# Altium schematic sheet Morpheus_conector.SchDoc
size A4
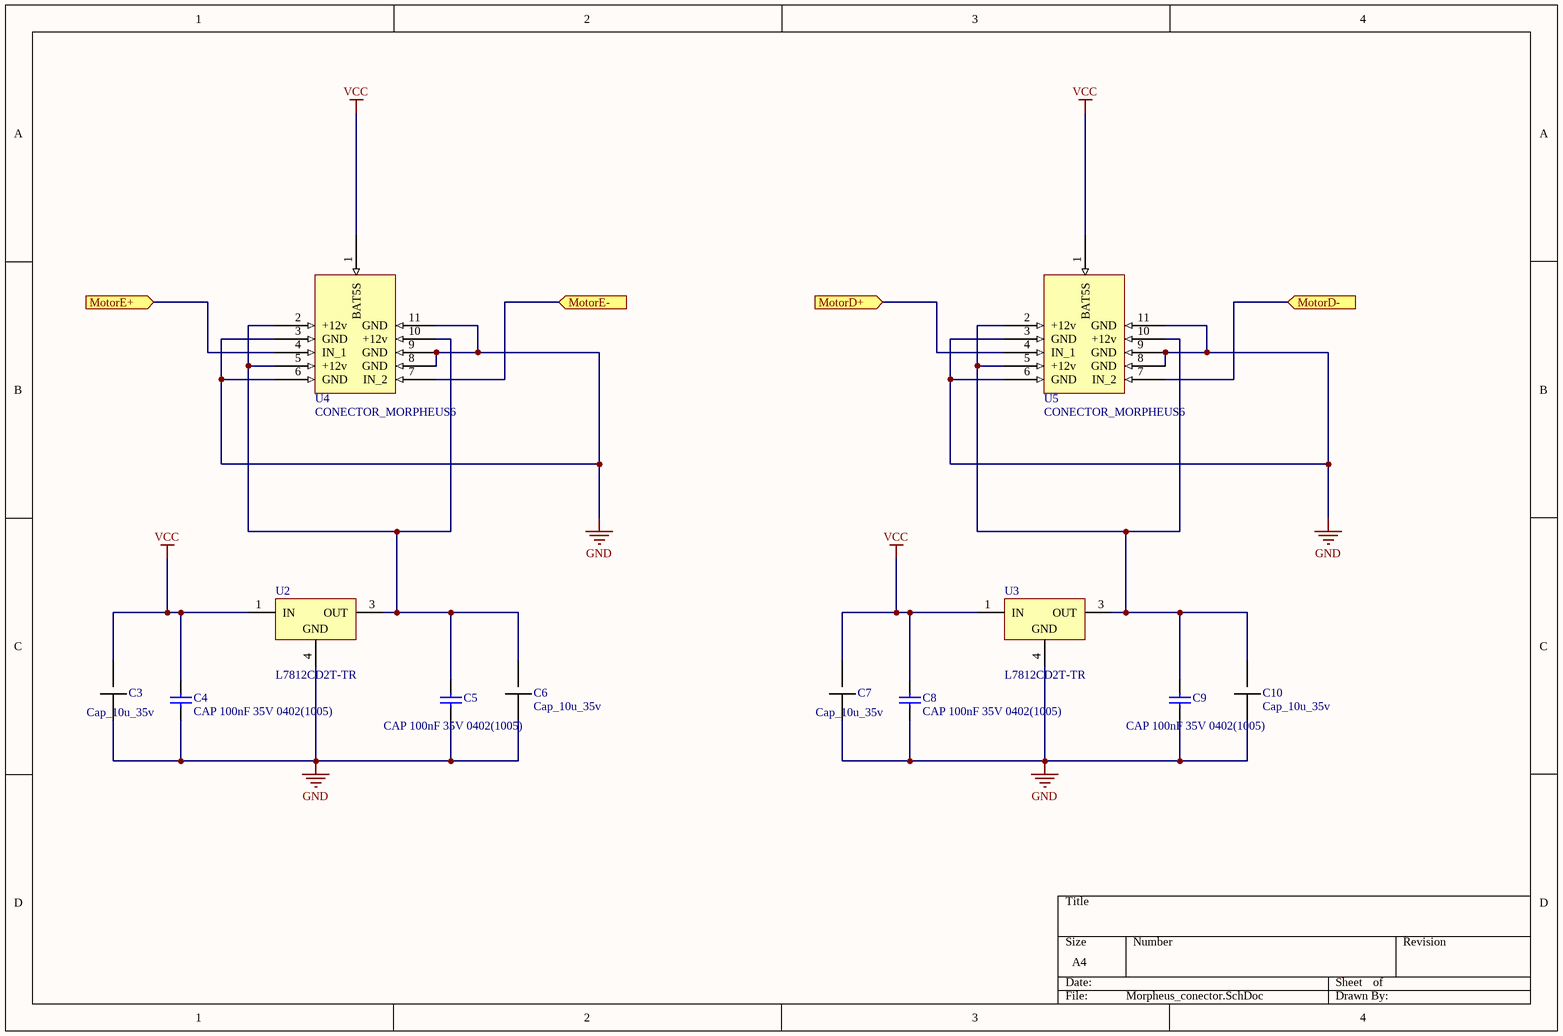
[diagram p0: Morpheus_conector.SchDoc]

## Parts
C3  Cap_10u_35v  [CAP POL 2917/7343]
C4  CAP 100nF 35V 0402(1005)  [CAPC0402(1005)60_N]
C5  CAP 100nF 35V 0402(1005)  [CAPC0402(1005)60_N]
C6  Cap_10u_35v  [CAP POL 2917/7343]
C7  Cap_10u_35v  [CAP POL 2917/7343]
C8  CAP 100nF 35V 0402(1005)  [CAPC0402(1005)60_N]
C9  CAP 100nF 35V 0402(1005)  [CAPC0402(1005)60_N]
C10  Cap_10u_35v  [CAP POL 2917/7343]
U2  L7812CD2T-TR  [TO-263_N]
U3  L7812CD2T-TR  [TO-263_N]
U4  CONECTOR_MORPHEUS6
U5  CONECTOR_MORPHEUS6

## Ports
MotorD+ (in), MotorD- (in), MotorE+ (in), MotorE- (in)

## Nets
GND: C3.1 C4.1 C5.1 C6.1 C7.1 C8.1 C9.1 C10.1 U2.4(GND) U3.4(GND) U4.3(GND) U4.6(GND) U4.8(GND) U4.9(GND) U4.11(GND) U5.3(GND) U5.6(GND) U5.8(GND) U5.9(GND) U5.11(GND)
VCC: C3.2 C4.2 C7.2 C8.2 U2.1(IN) U3.1(IN) U4.1(BAT5S) U5.1(BAT5S)
MotorD+: U5.4(IN_1) ; port MotorD+
MotorD-: U5.7(IN_2) ; port MotorD-
MotorE+: U4.4(IN_1) ; port MotorE+
MotorE-: U4.7(IN_2) ; port MotorE-
NetC5_2: C5.2 C6.2 U2.3(OUT) U4.2(+12v) U4.5(+12v) U4.10(+12v)
NetC9_2: C9.2 C10.2 U3.3(OUT) U5.2(+12v) U5.5(+12v) U5.10(+12v)

## Library data of the parts
C3 C6 C7 C10 = Cap_10u_35v: 80-T491D106M35AT7280
C4 C5 C9 = CMP-1034-02076-1: CAP 100nF 35V ±20% 0402 (1005 Metric) Thickness 0.6mm SMD                                                 963-GMK105BJ104MV-F; Case-Metric: 1005; Tolerance: Â±20%; Case-EIA: 0402; Rated Voltage: 35 V; Max Thickness: 0.6 mm; Value: 100nF; Technology: SMT
C8 = CMP-1034-02076-1: CAP 100nF 35V ±20% 0402 (1005 Metric) Thickness 0.6mm SMD                                        963-GMK105BJ104MV-F; Case-Metric: 1005; Tolerance: Â±20%; Case-EIA: 0402; Rated Voltage: 35 V; Max Thickness: 0.6 mm; Value: 100nF; Technology: SMT
U2 U3 = CMP-0244-00182-1: Positive Voltage Regulator, 3-Pin D2PAK, Tape and Reel; PackageDescription: 3-Pin Transistor Outline Package 2.54 mm Pitch, 15.4 mm Lead Span (D2PAK); ComponentLink1Description: Manufacturer URL; PackageReference: TO-263; DatasheetVersion: 16/11/2011; ComponentLink2URL: http://www.st.com/internet/com/TECHNICAL_RESOURCES/TECHNICAL_LITERATURE/DATASHEET/CD00000444.pdf; ComponentLink1URL: http://www.st.com; PackageVersion: 2011; ComponentLink2Description: Datasheet